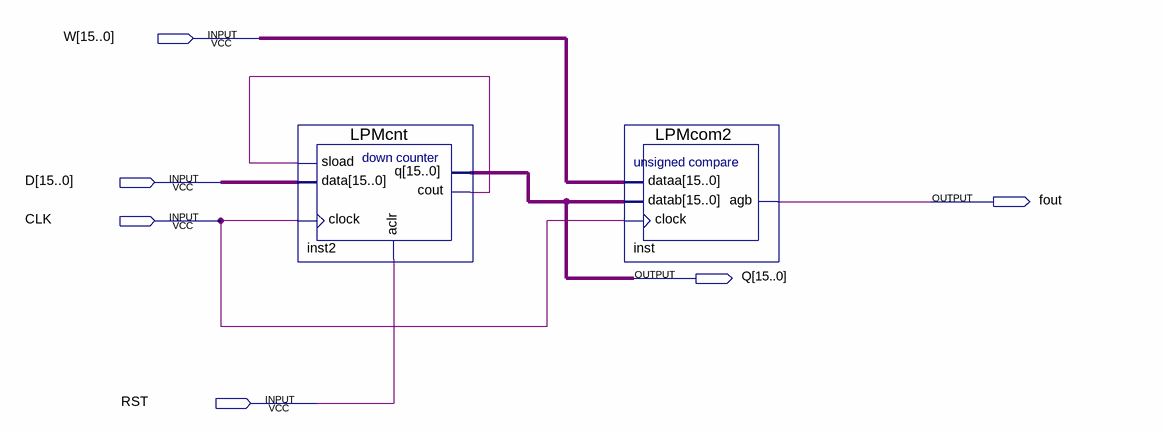
[diagram p0: schematic sheet]
// Quartus schematic lab504LPMPRRvwf.bdf as structural Verilog: 2 symbols, 6 pins
module lab504LPMPRRvwf (
  input  [15:0] W,
  input  [15:0] D,
  input  CLK,
  input  RST,
  output fout,
  output [15:0] Q
);

  wire inst2_cout;

  LPMcnt inst2 (.sload(inst2_cout), .data(D), .clock(CLK), .aclr(RST), .cout(inst2_cout), .q(Q));
  LPMcom2 inst (.dataa(W), .datab(Q), .clock(CLK), .agb(fout));
endmodule
